# Altium schematic sheet [05] - AUDIO.SchDoc
size A3; DocumentNumber: 5; SheetNumber: 5; SheetTotal: 8
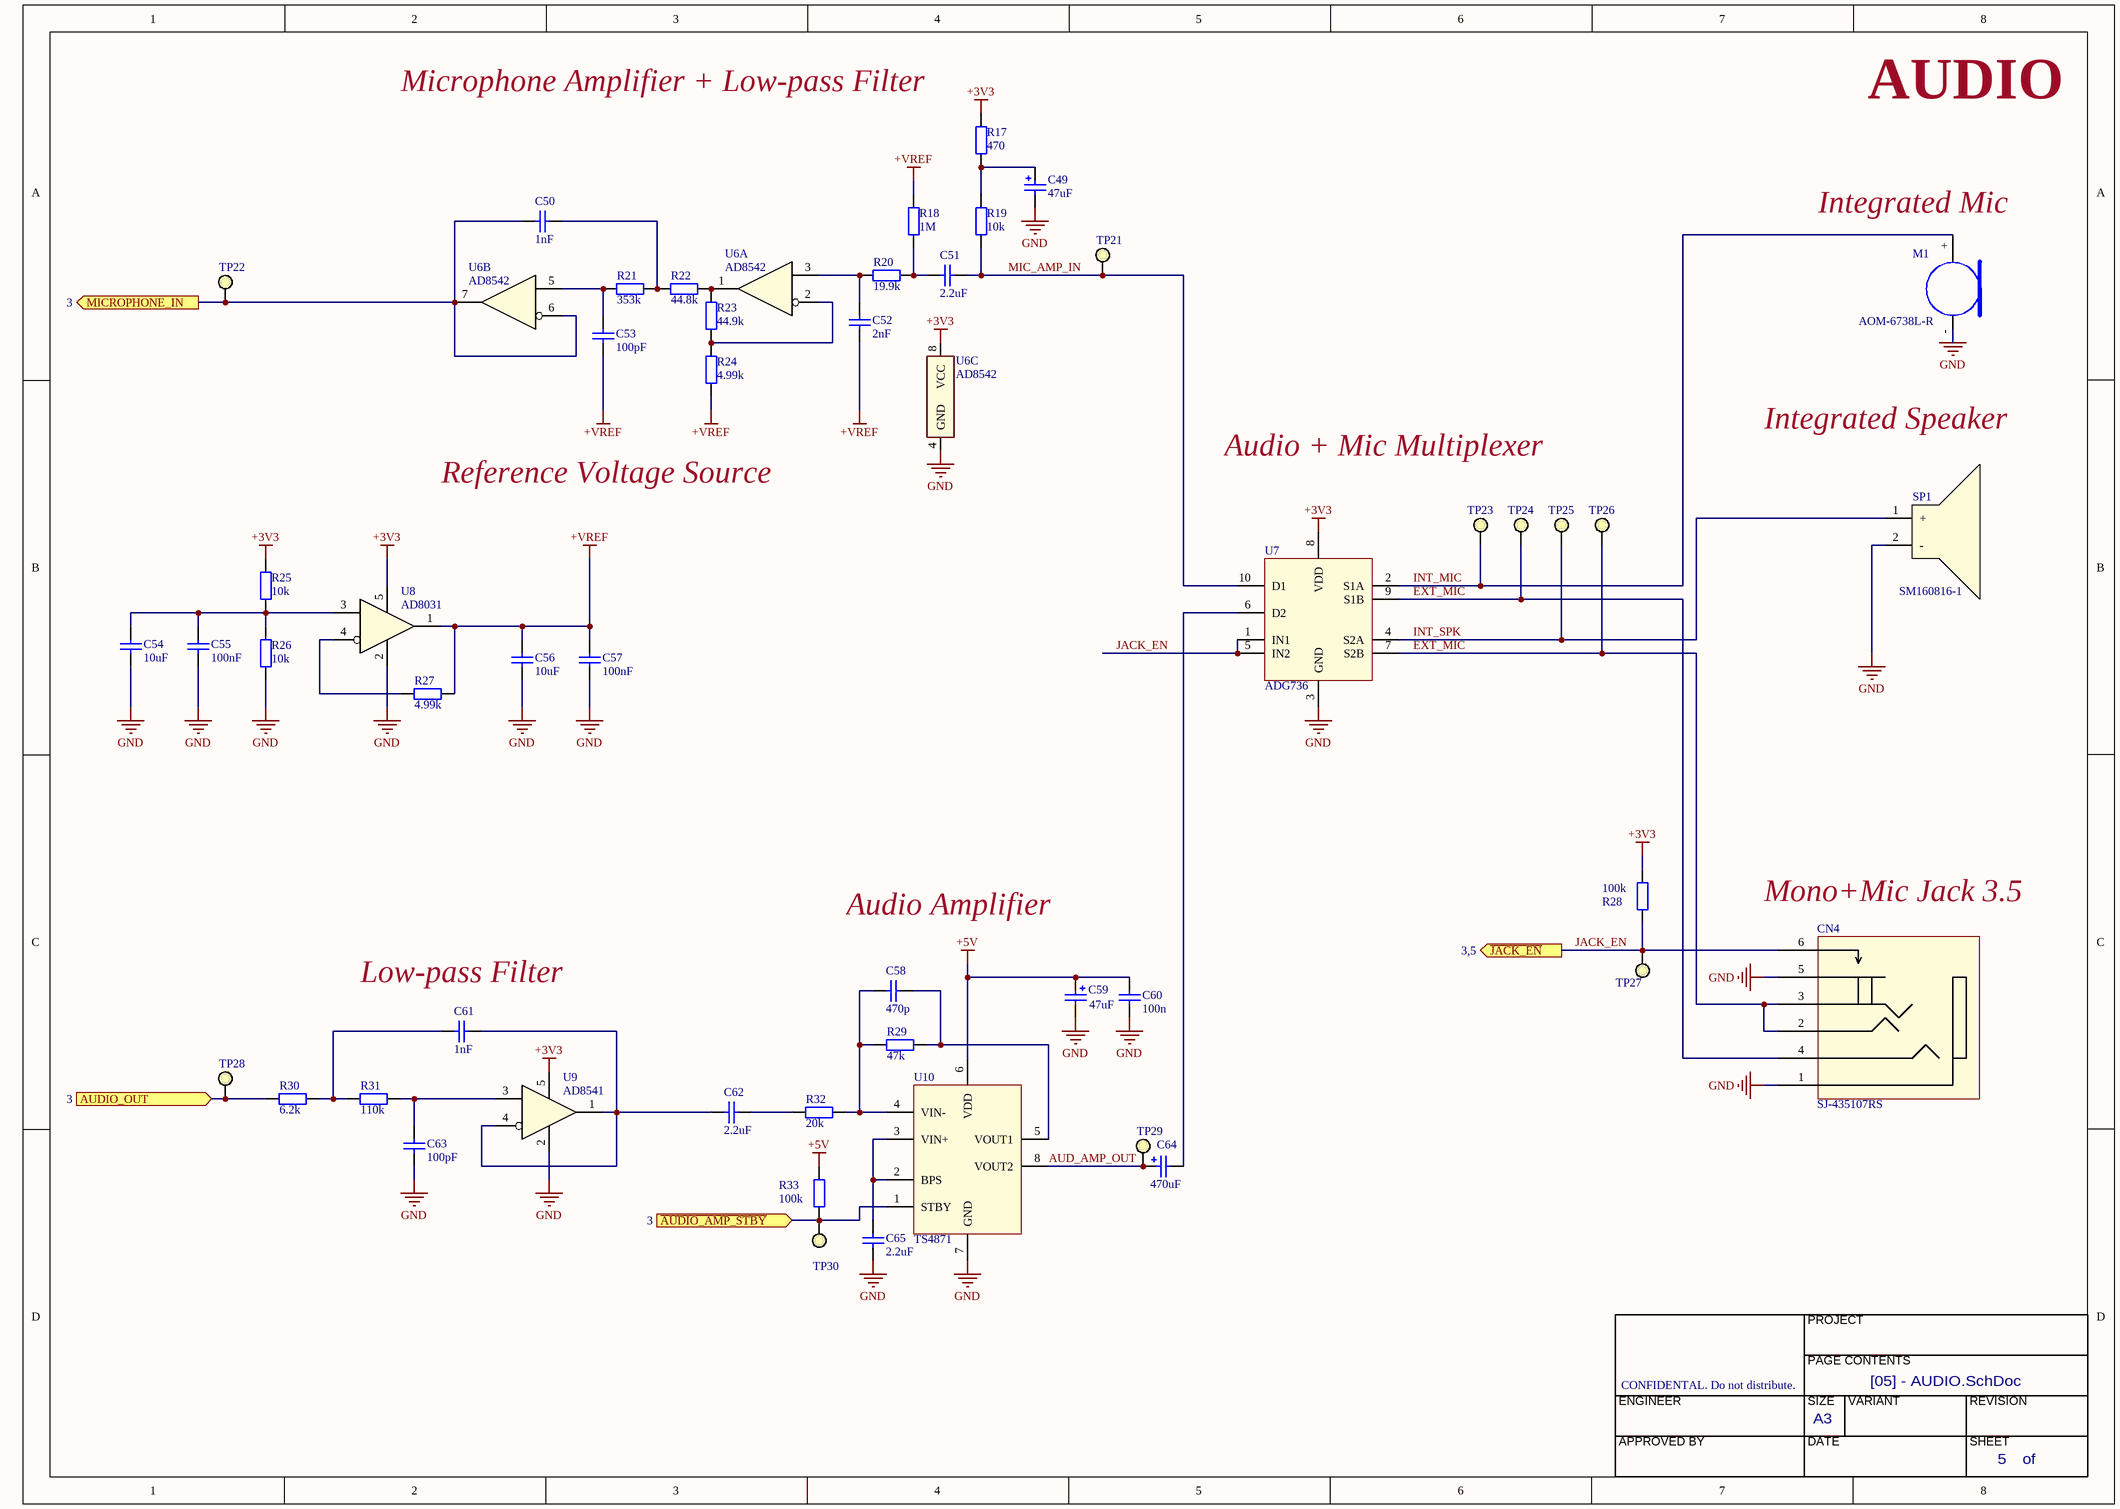
[diagram p0: [05] - AUDIO.SchDoc]

## Parts
C49  47uF  [CAPPR2-4x6.8]
C50  1nF  [CAP0402]
C51  2.2uF  [CAP0402]
C52  2nF  [CAP0402]
C53  100pF  [CAP0402]
C54  10uF  [CAP0402]
C55  100nF  [CAP0402]
C56  10uF  [CAP0402]
C57  100nF  [CAP0402]
C58  470p  [CAP0402]
C59  47uF  [CAPPR2-4x6.8]
C60  100n  [CAP0402]
C61  1nF  [CAP0402]
C62  2.2uF  [CAP0402]
C63  100pF  [CAP0402]
C64  470uF  [CAPPR2-4x6.8]
C65  2.2uF  [CAP0402]
CN4  SJ-435107RS
M1  AOM-6738L-R
R17  470  [RES0402]
R18  1M  [RES0402]
R19  10k  [RES0402]
R20  19.9k  [RES0402]
R21  353k  [RES0402]
R22  44.8k  [RES0402]
R23  44.9k  [RES0402]
R24  4.99k  [RES0402]
R25  10k  [RES0402]
R26  10k  [RES0402]
R27  4.99k  [RES0402]
R28  100k  [RES0402]
R29  47k  [RES0402]
R30  6.2k  [RES0402]
R31  110k  [RES0402]
R32  20k  [RES0402]
R33  100k  [RES0402]
SP1  SM160816-1
TP21  TestPoint  [TestPoint]  (value not drawn)  (no BOM)
TP22  TestPoint  [TestPoint]  (value not drawn)  (no BOM)
TP23  TestPoint  [TestPoint]  (value not drawn)  (no BOM)
TP24  TestPoint  [TestPoint]  (value not drawn)  (no BOM)
TP25  TestPoint  [TestPoint]  (value not drawn)  (no BOM)
TP26  TestPoint  [TestPoint]  (value not drawn)  (no BOM)
TP27  TestPoint  [TestPoint]  (value not drawn)  (no BOM)
TP28  TestPoint  [TestPoint]  (value not drawn)  (no BOM)
TP29  TestPoint  [TestPoint]  (value not drawn)  (no BOM)
TP30  TestPoint  [TestPoint]  (value not drawn)  (no BOM)
U6  AD8542  [SOIC8]  (parts A,B,C of 3)
U7  ADG736
U8  AD8031  [SOT23-5_PITCH0.95]
U9  AD8541  [SOT23-5_PITCH0.95]
U10  TS4871

## Ports
AUDIO_OUT (in, see 3), MICROPHONE_IN (out, see 3), ~{AUDIO_AMP_STBY} (in, see 3), ~{JACK_EN} (out, see 3,5)

## Nets
+3V3: R17.2 R25.2 R28.1 U6.8(VCC) U7.8(VDD) U8.5(VCC+) U9.5(VCC+)
+5V: C59.1 C60.2 R33.1 U10.6(VDD)
+VREF: C52.1 C53.1 C56.2 C57.2 R18.2 R24.1 R27.1 U8.1(OUT)
GND: C49.2 C54.1 C55.1 C56.1 C57.1 C59.2 C60.1 C63.1 C65.1 CN4.1 CN4.5 M1.- R26.1 SP1.2(-) U6.4(GND) U7.3(GND) U8.2(VCC-) U9.2(VCC-) U10.7(GND)
~{AUDIO_AMP_STBY}: R33.2 TP30.1 U10.1(STBY) ; port ~{AUDIO_AMP_STBY}
AUD_AMP_OUT: C64.1 TP29.1 U10.8(VOUT2)
AUDIO_OUT: R30.1 TP28.1 ; port AUDIO_OUT
EXT_MIC: CN4.2 CN4.3 CN4.4 TP24.1 TP26.1 U7.7(S2B) U7.9(S1B)
INT_MIC: M1.+ TP23.1 U7.2(S1A)
INT_SPK: SP1.1(+) TP25.1 U7.4(S2A)
JACK_EN: CN4.6 R28.2 TP27.1 U7.1(IN1) U7.5(IN2) ; port ~{JACK_EN}
MIC_AMP_IN: C51.1 R19.1 TP21.1 U7.10(D1)
MICROPHONE_IN: C50.2 TP22.1 U6.6(IN-) U6.7(OUT) ; port MICROPHONE_IN
NetC49_1: C49.1 R17.1 R19.2
NetC50_1: C50.1 R21.2 R22.1
NetC51_2: C51.2 R18.1 R20.2
NetC52_2: C52.2 R20.1 U6.3(IN+)
NetC53_2: C53.2 R21.1 U6.5(IN+)
NetC54_2: C54.2 C55.2 R25.1 R26.2 U8.3(IN+)
NetC58_1: C58.1 R29.2 R32.1 U10.4(VIN-)
NetC58_2: C58.2 R29.1 U10.5(VOUT1)
NetC61_1: C61.1 R30.2 R31.1
NetC61_2: C61.2 C62.1 U9.1(OUT) U9.4(IN-)
NetC62_2: C62.2 R32.2
NetC63_2: C63.2 R31.2 U9.3(IN+)
NetC64_2: C64.2 U7.6(D2)
NetC65_2: C65.2 U10.2(BPS) U10.3(VIN+)
NetR22_2: R22.2 R23.2 U6.1(OUT)
NetR23_1: R23.1 R24.2 U6.2(IN-)
NetR27_2: R27.2 U8.4(IN-)

## Notes on the sheet
- (near R17) Microphone Amplifier + Low-pass Filter
- AUDIO
- (near M1) Integrated Mic
- Integrated Speaker
- Reference Voltage Source
- Audio + Mic Multiplexer
- Audio Amplifier
- (near CN4) Mono+Mic Jack 3.5
- (near C61) Low-pass Filter
- PROJECT
- CONFIDENTAL. Do not distribute.
- PAGE CONTENTS
- ENGINEER
- APPROVED BY
- SIZE
- DATE
- A3
- VARIANT
- REVISION
- SHEET
- of

## Library data of the parts
C49 C59 C64 = Cap Pol: Polarized Capacitor; Manufacturer: *; Manufacturer Part Number: *; Supplier 1: Digi-Key; Supplier Part Number 1: *; Supplier Price 1: *
C50-C58 C60-C63 C65 = Cap: Capacitor; Manufacturer: *; Manufacturer Part Number: *; Supplier 1: Digi-Key; Supplier Part Number 1: *
M1 = Microphone
R17-R33 = Res: Resistor; Manufacturer: *; Manufacturer Part Number: *; Supplier 1: Digi-Key; Supplier Part Number 1: *
SP1 = Speaker
U6 = OPAMP x2
U8 U9 = OPAMP x1